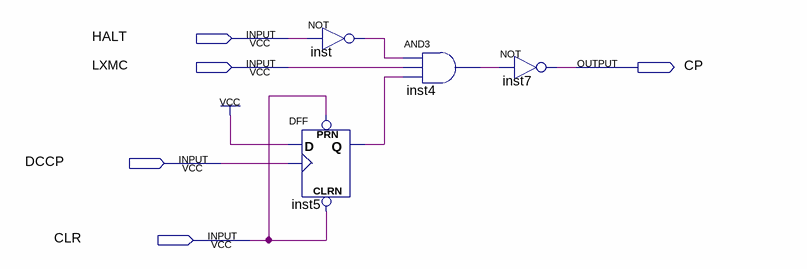
[diagram p0: schematic sheet]
// Quartus schematic Driver.bdf as structural Verilog: 4 symbols, 5 pins
module Driver (
  input  HALT,
  input  LXMC,
  input  DCCP,
  input  CLR,
  output CP
);

  wire inst4_out, inst5_q, inst_out;

  not inst (inst_out, HALT);
  DFF inst5 (.CLRN(CLR), .CLK(DCCP), .D(1'b1), .PRN(CLR), .Q(inst5_q));
  and inst4 (inst4_out, inst_out, LXMC, inst5_q);
  not inst7 (CP, inst4_out);
endmodule
